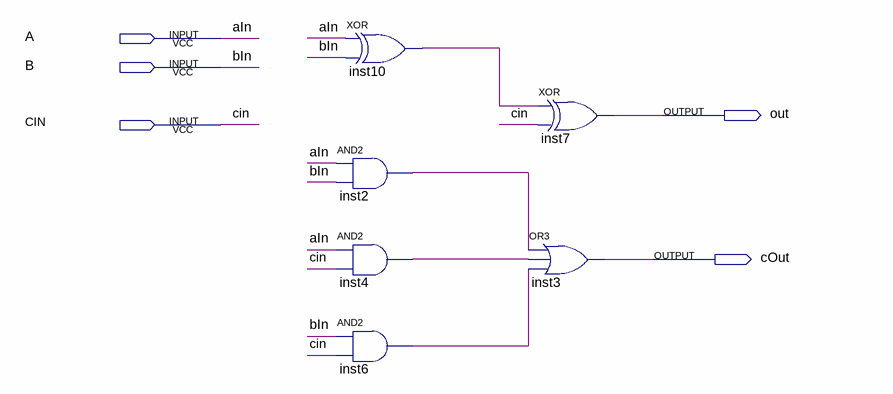
[diagram p0: schematic sheet]
// Quartus schematic fulladd.bdf as structural Verilog: 6 symbols, 5 pins
module fulladd (
  input  A,
  input  B,
  input  CIN,
  output out,
  output cOut
);

  wire inst2_out, inst4_out, inst6_out, inst10_out;

  xor inst10 (inst10_out, A, B);
  and inst2 (inst2_out, A, B);
  and inst4 (inst4_out, A, CIN);
  and inst6 (inst6_out, B, CIN);
  xor inst7 (out, inst10_out, CIN);
  or inst3 (cOut, inst2_out, inst4_out, inst6_out);

  // Other names for the same wires on the sheet: aIn = A; bIn = B
endmodule
